# Altium schematic sheet Prometheus_ADC_V1.1.SchDoc
size A
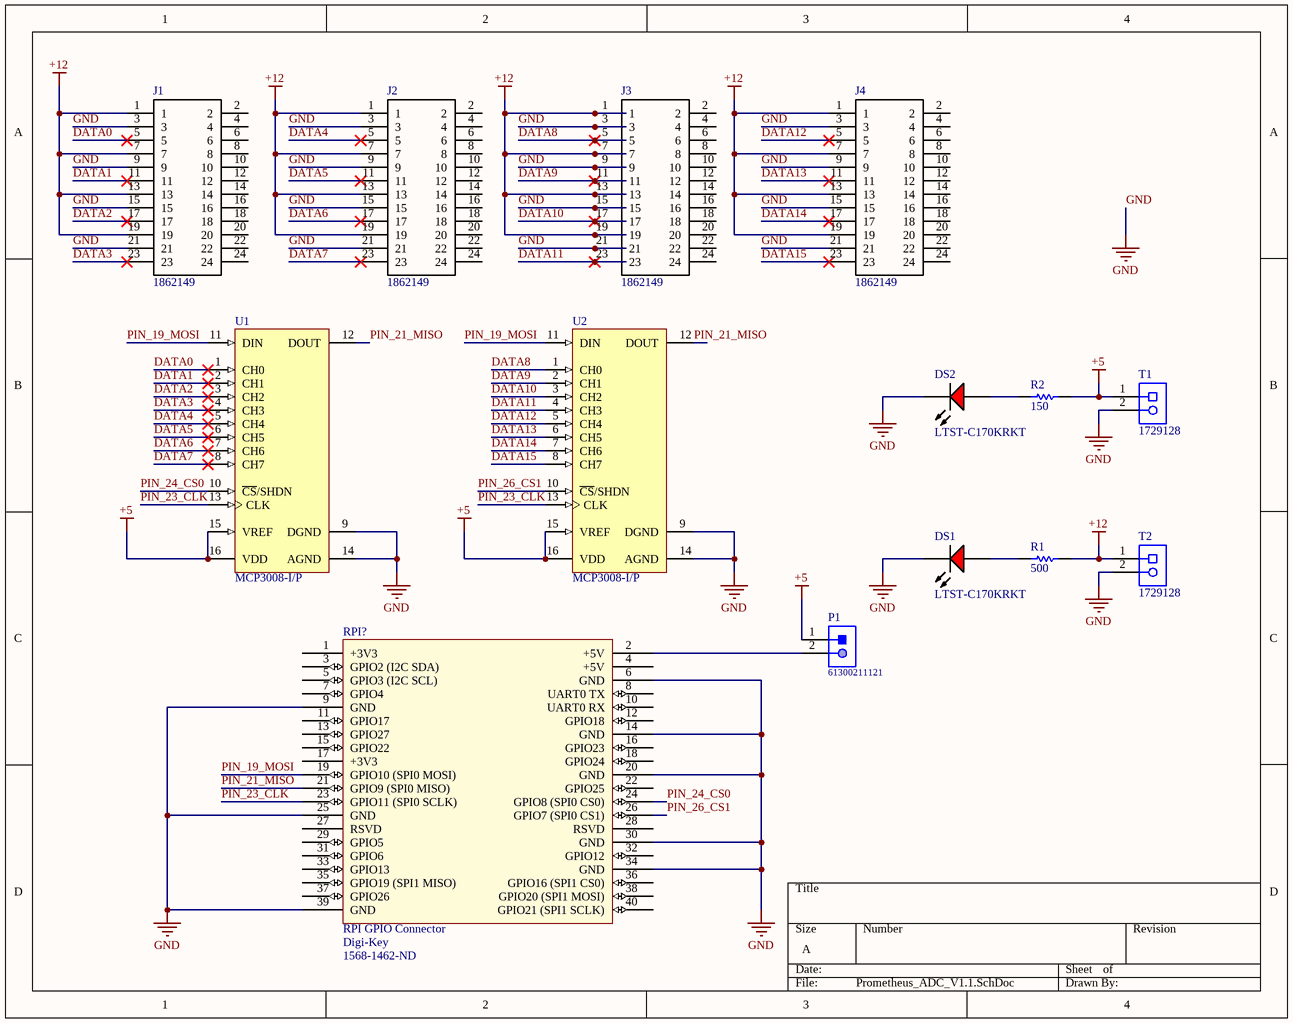
[diagram p0: Prometheus_ADC_V1.1.SchDoc]

## Parts
DS1  LTST-C170KRKT  [LTST-C170KRKT_V]
DS2  LTST-C170KRKT  [LTST-C170KRKT_V]
J1  1862149  [SHDR24W90P500X350_2X12_4350X1100X1020P]
J2  1862149  [SHDR24W90P500X350_2X12_4350X1100X1020P]
J3  1862149  [SHDR24W90P500X350_2X12_4350X1100X1020P]
J4  1862149  [SHDR24W90P500X350_2X12_4350X1100X1020P]
P1  61300211121  [61300211121]
R1  500  [RESC1206(3216)_M]
R2  150  [RESC1206(3216)_M]
RPI?  RPI GPIO Connector  Supplier 1: Digi-Key  Supplier Part Number 1: 1568-1462-ND  [rpi]
T1  1729128  [PHOE-1729128-2_V]
T2  1729128  [PHOE-1729128-2_V]
U1  MCP3008-I/P  [PDIP300-P16]
U2  MCP3008-I/P  [PDIP300-P16]

## Nets
+5: P1.1 R2.1 T1.1 U1.15(VREF) U1.16(VDD) U2.15(VREF) U2.16(VDD)
+12: J1.1 J1.7 J1.13 J1.19 J2.1 J2.7 J2.13 J2.19 J3.1 J3.7 J3.13 J3.19 J4.1 J4.7 J4.13 J4.19 R1.1 T2.1
GND: DS1.2(K) DS2.2(K) J1.3 J1.9 J1.15 J1.21 J2.3 J2.9 J2.15 J2.21 J3.3 J3.9 J3.15 J3.21 J4.3 J4.9 J4.15 J4.21 RPI?.6(GND) RPI?.9(GND) RPI?.14(GND) RPI?.20(GND) RPI?.25(GND) RPI?.30(GND) RPI?.34(GND) RPI?.39(GND) T1.2 T2.2 U1.9(DGND) U1.14(AGND) U2.9(DGND) U2.14(AGND)
DATA0: J1.5 U1.1(CH0)
DATA1: J1.11 U1.2(CH1)
DATA2: J1.17 U1.3(CH2)
DATA3: J1.23 U1.4(CH3)
DATA4: J2.5 U1.5(CH4)
DATA5: J2.11 U1.6(CH5)
DATA6: J2.17 U1.7(CH6)
DATA7: J2.23 U1.8(CH7)
DATA8: J3.5 U2.1(CH0)
DATA9: J3.11 U2.2(CH1)
DATA10: J3.17 U2.3(CH2)
DATA11: J3.23 U2.4(CH3)
DATA12: J4.5 U2.5(CH4)
DATA13: J4.11 U2.6(CH5)
DATA14: J4.17 U2.7(CH6)
DATA15: J4.23 U2.8(CH7)
PIN_19_MOSI: RPI?.19(GPIO10_(SPI0_MOSI)) U1.11(DIN) U2.11(DIN)
PIN_21_MISO: RPI?.21(GPIO9_(SPI0_MISO)) U1.12(DOUT) U2.12(DOUT)
PIN_23_CLK: RPI?.23(GPIO11_(SPI0_SCLK)) U1.13(CLK) U2.13(CLK)
PIN_24_CS0: RPI?.24(GPIO8_(SPI0_CS0)) U1.10(~{CS}/SHDN)
PIN_26_CS1: RPI?.26(GPIO7_(SPI0_CS1)) U2.10(~{CS}/SHDN)
NetDS1_1: DS1.1(A) R1.2
NetDS2_1: DS2.1(A) R2.2
NetP1_2: P1.2 RPI?.2(+5V)

Not connected (* = marked no-connect by the designer): J1 2 4 6 8 10 12 14 16 18 20 22 24; J2 2 4 6 8 10 12 14 16 18 20 22 24; J3 2 4 6 8 10 12 14 16 18 20 22 24; J4 2 4 6 8 10 12 14 16 18 20 22 24; RPI? 1(+3V3) 3(GPIO2_(I2C_SDA)) 4(+5V) 5(GPIO3_(I2C_SCL)) 7(GPIO4) 8(UART0_TX) 10(UART0_RX) 11(GPIO17) 12(GPIO18) 13(GPIO27) 15(GPIO22) 16(GPIO23) 17(+3V3) 18(GPIO24) 22(GPIO25) 27(RSVD) 28(RSVD) 29(GPIO5) 31(GPIO6) 32(GPIO12) 33(GPIO13) 35(GPIO19_(SPI1_MISO)) 36(GPIO16_(SPI1_CS0)) 37(GPIO26) 38(GPIO20_(SPI1_MOSI)) 40(GPIO21_(SPI1_SCLK))

## Library data of the parts
DS1 DS2 = CMP-2000-07593-1: LED Red, 75 mW, 54 mcd, -55 to 85 degC, 2-Pin SMD, RoHS, Tape and Reel; Manufacturer: Lite-On; Lens Transparency: Clear; Number of Elements: 1; Power Rating: 75mW; Luminous Intensity: 54mcd; Viewing Angle: 130degrees; Forward Current: 30mA; Wavelength: 639nm; Lens Style: Rectangular; Case\/Package: 0805; Test Current: 20mA; Dominant Wavelength: 631nm; Forward Voltage: 2V; Lens Colour: Colorless; Min Operating Temperature: -55degC; RoHSCompliant: True; Length: 3.2mm; Width: 1.25mm; Mount: SurfaceMount; Packaging: TapeandReel; Number of LEDs: 1; Radiation Hardening: No; Datasheet URL: http://optoelectronics.liteon.com/upload/download/DS-22-99-0150/LTST-C170KRKT.pdf; Datasheet Version: Rev. D, 11/2014; Case Code (Metric): 2012; Height: 1.1mm; Number of Pins: 2; Package Description: 2-Pin Surface Mount Device, Body 2 x 1.25 mm; Manufacturer URL: http://www.us.liteon.com/; Lead Free: LeadFree; Illumination Colour: Red; Colour: Red; Case Code (Imperial): 0805; Max Operating Temperature: 85degC; Power Dissipation: 75mW; Mounting Technology: SurfaceMount; Package Reference: C170KRKT; Package Quantity: 1; Depth: 1.6mm
J1-J4 = 1862149: Connector; Manufacturer_Name: Phoenix Contact; Datasheet Link: https://www.phoenixcontact.com/online/portal/gb/?uri=pxc-oc-itemdetail:pid=1862149&library=gben&pcck=P-11-01-05&tab=1&selectedCategory=ALL; Height: 10.2mm; Manufacturer_Part_Number: 1862149; Mouser Part Number: 651-1862149; Mouser Price/Stock: https://www.mouser.com/Search/Refine.aspx?Keyword=651-1862149; RS Part Number: 1511319; RS Price/Stock: http://uk.rs-online.com/web/p/products/1511319
P1 = CMP-1502-01060-1: THT Vertical Pin Header WR-PHD, Pitch 2.54 mm, Single Row, 2 pins; Manufacturer: Wurth Elektronik; Rated Current: 3A; Gender: Male; Withstanding Voltage: 500VAC; Working Voltage: 250VAC; Pitch: 2.54mm; Contact Resistance: 20mOhm; Pin Number: 2; Mounting Technology: THT; Orientation: Vertical; Operating Temperature: -40to105degC; Packaging: Bag; Publisher: WurthElektronik; Datasheet URL: https://katalog.we-online.de/em/datasheet/6130xx11121.pdf; Manufacturer URL: http://www.we-online.de; Row Number: Single; Package Reference: 61300211121; Part Number: 61300211121
R1 R2 = CMP-1014-00526-1: 1K43 0.25W 1% 1206 (3216 Metric)  SMD; Value: 1430.00 Ohm; Case-EIA: 1206; Case-Metric: 3216; Power: 0.25 W; Technology: SMT; Tolerance: 1 %
RPI? = rpi connector: GPIO Header for Raspberry Pi A+/B+/Pi 2/Pi 3 - 2x20; Manufacturer: SparkFun Electronics; Manufacturer Part Number: PRT-14017; Nils Minor: author; nilsminor@web.de: mail; RoHS: RoHS Compliant; Category: Development Boards, Kits, Programmers; Stock 1: 150; Pricing 1: 1=1.84 (EUR); Part Status: Active; Accessory Type: Connector; For Use With/Related Products: Raspberry Pi; ComponentLink1URL: https://cdn.sparkfun.com/datasheets/Dev/RaspberryPi/12313.pdf; ComponentLink1Description: https://cdn.sparkfun.com/datasheets/Dev/RaspberryPi/12313.pdf
T1 T2 = CMP-2000-05815-1: PCB Terminal Block, 13.5 A, 400 V, 2-Pin THD, RoHS, Bulk; Manufacturer: Phoenix Contact; Package Version: 03/2015; No. of Rows: 1; Pitch: 5.08mm; No. of Positions: 2; Voltage Rating: 400V; Current Rating: 13500mA; Manufacturer URL: http://www.phoenixcontact.com/; Datasheet URL: https://datasheet.ciiva.com/16046/1729128-16046181.pdf; RoHS: TRUE; Package URL: https://www.phoenixcontact.com/online/portal/pi/pxc/product_detail_page/!ut/p/b1/3VdJjqNKFDxLH8AFycySyWY2ozFsEPOMMQaDOX1XedGL_1Vdm5YXJleknhSKeBkvI6EA8ncAo3AYoDhBQGco6KN7VURTdemj9us_IEKEZo_YHiPAEWEFmDGOHMORkqKYCORBZxgL7ZoaZYcbFFUZ3fqxSY6GOuxydWUuHqz1ynmMFygu583Bob0Ewr6Sd_l-5m-kAueHiB0jpRwZwe58wwtkpxtMYd_LmGcDRU02dRNEyWt6Y2ti5pSyJ_reIkzIulrqApdnbT11V5jnCKbYNCvhEM1MCpPByat_X379-iThf08CI5GfOPqfBeS3BRoBOdD55AKVv0iLwCMq-2BrzXWSGRH7pUGD9uwXQjiph3xL0DKQwdGa0JImiIOmBNOestqgwTHSSs2oOep-78apyXQBvNi8ZLaFjvjWvcaUEBu0MC6Wbe-d6mB0FAebo2lUWinqYaZs5DAYzV0RP9yitUjnGJ0iI9xhZkT42OCQNUJJhkgWINNQLP2JFP6OpMg3JCVg70jqHT0lvKOnhHf0lPuOnnLf0VPuWx6_dxwUIvwk5WMkT0kLL1mh61l2yZVSzG3pYV_bqo-mj6uMKwKwdnnW8Jh5RTOJzMOA5c-eJDaZQw4mTMPH02PvS_ZAqNVjVTo2WyYLkwH_KU1mmmG5kjRhDqPXLwwVHvVOjCM60-fpXvTDfMGW1PVFVS1r4e4yVDk4ZdNbkUHvqPqQSeian4UD39fNKmachqdJ1NJbyk8rXT9mXTvPk3oE5meulKGgiruPJek-4I9hTT6G8ZLOyRSm2RRVbThERQad5OS28hdt4YW4vG0stgYYzsWsK4_7y6DZMjJSCqri1kyiZR5vD7pwIrNR7QwPHTcLTI5qT7eRlpHrdGiupYlqQDJ7zy_CND8fWWBoLRXxk1RVcXiBQwbTD4Xi7KL-FuO94t9xaqweXzH; PartNumber: 1729128; Package Description: 2-Pin Through Hole Device, Body 8.1 x 10.16 mm, Pitch 5.08 mm; Datasheet Version: 12/2013; Mounting Technology: ThroughHole; Orientation: Horizontal; Package Reference: 1729128-2; Packing: Bulk
U1 U2 = CMP-0188-00184-2: 2.7V 4-Channel/8-Channel 10-Bit A/D Converters with SPI Serial Interface, 16-Pin PDIP, Industrial Temperature; ComponentLink1URL: http://www.microchip.com/; ComponentLink2URL: http://ww1.microchip.com/downloads/en/DeviceDoc/21295d.pdf; PackageVersion: revBB, Aug-2009; ComponentLink3URL: http://www.microchip.com/stellent/groups/techpub_sg/documents/packagingspec/en012702.pdf; DatasheetVersion: revD, Dec-2008; PackageDescription: 16-Lead Plastic Dual In-Line (P) - 300 mil Body [PDIP]; ComponentLink3Description: Package Specification; Code_JEDEC: MS-001-BB; ComponentLink1Description: Manufacturer URL; RevisionNote: URLs added.; PackageReference: PDIP300-P16; ComponentLink2Description: Datasheet